# EAGLE schematic doorctrl (EAGLE 5.10)
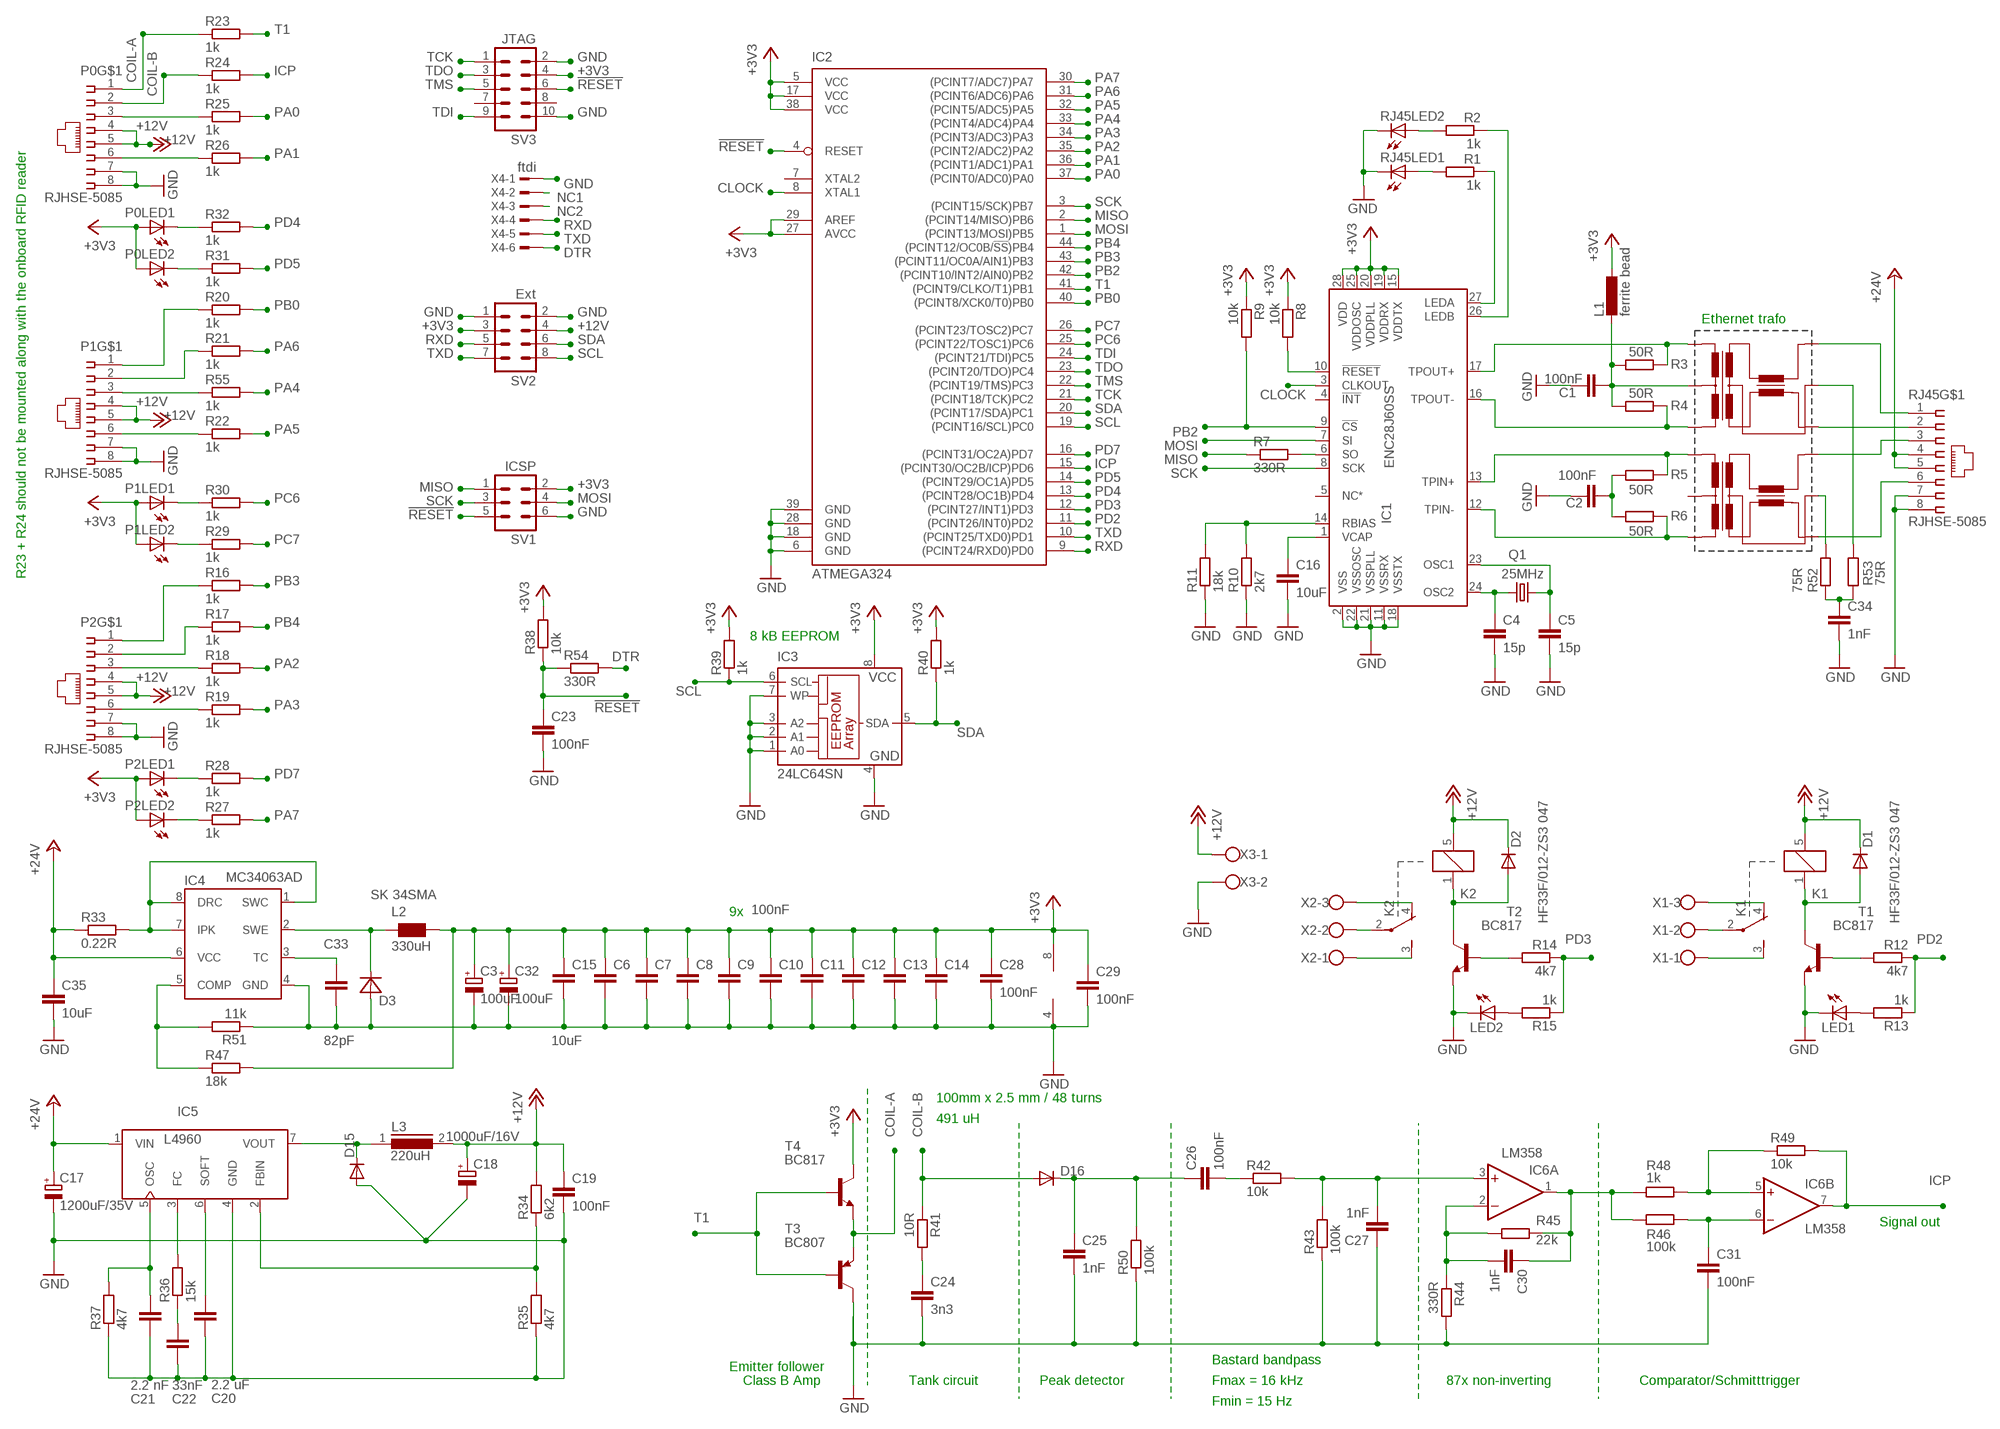
[diagram p0: schematic, sheet 1]

## Parts
C1  100nF  C-EUC0805  [C0805]
C2  100nF  C-EUC0805  [C0805]
C3  100uF  CPOL-EUSANYO_SMD_C6  [SANYO-OSCON_SMD_C6]
C4  15p  C-EUC0805  [C0805]
C5  15p  C-EUC0805  [C0805]
C6  100nF  C-EUC0805  [C0805]
C7  100nF  C-EUC0805  [C0805]
C8  100nF  C-EUC0805  [C0805]
C9  100nF  C-EUC0805  [C0805]
C10  100nF  C-EUC0805  [C0805]
C11  100nF  C-EUC0805  [C0805]
C12  100nF  C-EUC0805  [C0805]
C13  100nF  C-EUC0805  [C0805]
C14  100nF  C-EUC0805  [C0805]
C15  10uF  C-EUC0805  [C0805]
C16  10uF  C-EUC0805  [C0805]
C17  1200uF/35V  CPOL-EUE5-13  [E5-13]
C18  1000uF/16V  CPOL-EUE5-13  [E5-13]
C19  100nF  C-EUC0805  [C0805]
C20  2.2 uF  C-EUC0805  [C0805]
C21  2.2 nF  C-EUC0805  [C0805]
C22  33nF  C-EUC0805  [C0805]
C23  100nF  C-EUC0805  [C0805]
C24  3n3  C-EUC0805  [C0805]
C25  1nF  C-EUC0805  [C0805]
C26  100nF  C-EUC0805  [C0805]
C27  1nF  C-EUC0805  [C0805]
C28  100nF  C-EUC0805  [C0805]
C29  100nF  C-EUC0805  [C0805]
C30  1nF  C-EUC0805  [C0805]
C31  100nF  C-EUC0805  [C0805]
C32  100uF  CPOL-EUSANYO_SMD_C6  [SANYO-OSCON_SMD_C6]
C33  82pF  C-EUC0805  [C0805]
C34  1nF  C-EUC0805  [C0805]
C35  10uF  C-EUC0805  [C0805]
D1  DIODE-MINIMELF  [MINIMELF]
D2  DIODE-MINIMELF  [MINIMELF]
D3  SK 34SMA  MBRA340T3  [SMA]
D15  DIODE-TO220V  [TO220ACS]
D16  DIODE-MINIMELF  [MINIMELF]
IC1  ENC28J60SS  [SSOP28]
IC2  ATMEGA324  ATMEGA644A  [TQFP44]
IC3  24LC64SN  [SO-08]
IC4  MC34063AD  [SO08]
IC5  L4960  [HEPTAWATT]
IC6  LM358  LM358D  [SO08]
K1  HF33F/012-ZS3 047  G5SB  [G5SB]
K2  HF33F/012-ZS3 047  G5SB  [G5SB]
L1  ferrite bead  L-EU0204V  [0204V@1]
L2  330uH  WE-TI_L  [WE-TI_L]
L3  220uH  A26GFC  [A26GFC]
LED1  LEDCHIP-LED0805  [CHIP-LED0805]
LED2  LEDCHIP-LED0805  [CHIP-LED0805]
P0  RJHSE-5085  [RJ45]
P1  RJHSE-5085  [RJ45]
P2  RJHSE-5085  [RJ45]
Q1  25MHz  CRYSTALHC49UP  [HC49UP]
R1  1k  R-EU_R0805  [R0805]
R2  1k  R-EU_R0805  [R0805]
R3  50R  R-EU_R0805  [R0805]
R4  50R  R-EU_R0805  [R0805]
R5  50R  R-EU_R0805  [R0805]
R6  50R  R-EU_R0805  [R0805]
R7  330R  R-EU_R0805  [R0805]
R8  10k  R-EU_R0805  [R0805]
R9  10k  R-EU_R0805  [R0805]
R10  2k7  R-EU_R0805  [R0805]
R11  18k  R-EU_R0805  [R0805]
R12  4k7  R-EU_R0805  [R0805]
R13  1k  R-EU_R0805  [R0805]
R14  4k7  R-EU_R0805  [R0805]
R15  1k  R-EU_R0805  [R0805]
R16  1k  R-EU_R0805  [R0805]
R17  1k  R-EU_R0805  [R0805]
R18  1k  R-EU_R0805  [R0805]
R19  1k  R-EU_R0805  [R0805]
R20  1k  R-EU_R0805  [R0805]
R21  1k  R-EU_R0805  [R0805]
R22  1k  R-EU_R0805  [R0805]
R23  1k  R-EU_R0805  [R0805]
R24  1k  R-EU_R0805  [R0805]
R25  1k  R-EU_R0805  [R0805]
R26  1k  R-EU_R0805  [R0805]
R27  1k  R-EU_R0805  [R0805]
R28  1k  R-EU_R0805  [R0805]
R29  1k  R-EU_R0805  [R0805]
R30  1k  R-EU_R0805  [R0805]
R31  1k  R-EU_R0805  [R0805]
R32  1k  R-EU_R0805  [R0805]
R33  0.22R  R-EU_0204/2V  [0204V]
R34  6k2  R-EU_R0805  [R0805]
R35  4k7  R-EU_R0805  [R0805]
R36  15k  R-EU_R0805  [R0805]
R37  4k7  R-EU_R0805  [R0805]
R38  10k  R-EU_R0805  [R0805]
R39  1k  R-EU_R0805  [R0805]
R40  1k  R-EU_R0805  [R0805]
R41  10R  R-EU_R0805  [R0805]
R42  10k  R-EU_R0805  [R0805]
R43  100k  R-EU_R0805  [R0805]
R44  330R  R-EU_R0805  [R0805]
R45  22k  R-EU_R0805  [R0805]
R46  100k  R-EU_R0805  [R0805]
R47  18k  R-EU_R0805  [R0805]
R48  1k  R-EU_R0805  [R0805]
R49  10k  R-EU_R0805  [R0805]
R50  100k  R-EU_R0805  [R0805]
R51  11k  R-EU_R0805  [R0805]
R52  75R  R-EU_R0805  [R0805]
R53  75R  R-EU_R0805  [R0805]
R54  330R  R-EU_R0805  [R0805]
R55  1k  R-EU_R0805  [R0805]
RJ45  RJHSE-5085  [RJ45]
SV1  ICSP  MA03-2  [MA03-2]
SV2  Ext  MA04-2  [MA04-2]
SV3  JTAG  MA05-2  [MA05-2]
T1  BC817  BC817-16-NPN-SOT23-BEC  [SOT23-BEC]
T2  BC817  BC817-16-NPN-SOT23-BEC  [SOT23-BEC]
T3  BC807  BC807-16-PNP-SOT23-BEC  [SOT23-BEC]
T4  BC817  BC817-16-NPN-SOT23-BEC  [SOT23-BEC]
U$1  PE-68517L  [PE-68517]
X1  W237-103  [W237-103]
X2  W237-103  [W237-103]
X3  W237-102  [W237-102]
X4  ftdi  TSW-106-02-S-S  [TSW-106-02-S-S]

## Nets
12VPULSE: D15.C IC5.7(VOUT) L3.1
!RESET: C23.1 IC2.4(RESET) R38.1 R54.1 SV1.5 SV3.6
+3V3: C3.+ C6.1 C7.1 C8.1 C9.1 C10.1 C11.1 C12.1 C13.1 C14.1 C15.1 C28.1 C29.1 C32.+ IC1.15(VDDTX) IC1.19(VDDRX) IC1.20(VDDPLL) IC1.25(VDDOSC) IC1.28(VDD) IC2.5(VCC) IC2.17(VCC) IC2.27(AVCC) IC2.29(AREF) IC2.38(VCC) IC3.8(VCC) IC6.8(P:V+) L1.1 L2.1 P0.10(LED1:A) P0.12(LED2:A) P1.10(LED1:A) P1.12(LED2:A) P2.10(LED1:A) P2.12(LED2:A) R8.1 R9.1 R38.2 R39.2 R40.2 R47.2 SV1.2 SV2.3 SV3.4 T4.C
+12V: C18.+ C19.1 D1.C D2.C K1.5 K2.5 L3.2 P0.4 P0.5 P1.4 P1.5 P2.4 P2.5 R34.2 SV2.4 X3.1
+24V: C17.+ C35.1 IC4.6(VCC) IC5.1(VIN) R33.1 RJ45.4 RJ45.5
CLOCK: IC1.3(CLKOUT) IC2.8(XTAL1)
COIL-A: P0.1 R23.1 T3.E T4.E
COIL-B: D16.A P0.2 R24.1 R41.1
DTR: R54.2 X4.6
FC: IC5.3(FC) R36.2
GND: C1.1 C2.1 C3.- C4.2 C5.2 C6.2 C7.2 C8.2 C9.2 C10.2 C11.2 C12.2 C13.2 C14.2 C15.2 C16.2 C17.- C18.- C19.2 C20.2 C21.2 C22.2 C23.2 C24.2 C25.2 C27.1 C28.2 C29.2 C31.2 C32.- C33.2 C34.2 C35.2 D3.A D15.A IC1.2(VSS) IC1.11(VSSRX) IC1.18(VSSTX) IC1.21(VSSPLL) IC1.22(VSSOSC) IC2.6(GND) IC2.18(GND) IC2.28(GND) IC2.39(GND) IC3.1(A0) IC3.2(A1) IC3.3(A2) IC3.4(GND) IC3.7(WP) IC4.4(GND) IC5.4(GND) IC6.4(P:V-) LED1.C LED2.C P0.7 P0.8 P1.7 P1.8 P2.7 P2.8 R10.1 R11.1 R35.1 R37.1 R43.1 R44.2 R50.1 R51.1 RJ45.7 RJ45.8 RJ45.9(LED1:C) RJ45.11(LED2:C) SV1.6 SV2.1 SV2.2 SV3.2 SV3.10 T1.E T2.E T3.C X3.2 X4.1
ICP: IC2.15((PCINT30/OC2B/ICP)PD6) IC6.7(B:OUT) R24.2 R49.2
MEH1: P1.2 R21.1
MEH2: P1.1 R20.1
MISO: IC2.2((PCINT14/MISO)PB6) R7.1 SV1.1
MOSI: IC1.7(SI) IC2.1((PCINT13/MOSI)PB5) SV1.4
N$1: RJ45.1 U$1.9(RX+)
N$2: RJ45.2 U$1.10(RX-)
N$3: RJ45.3 U$1.8(TX+)
N$4: RJ45.6 U$1.7(TX-)
N$5: R2.2 RJ45.12(LED2:A)
N$6: R1.2 RJ45.10(LED1:A)
N$7: IC1.27(LEDA) R1.1
N$8: IC1.26(LEDB) R2.1
N$9: C1.2 L1.2 R3.2 R4.2 U$1.14(RCT)
N$10: P1.3 R55.1
N$12: IC1.10(!RESET) R8.2
N$13: C2.2 R5.2 R6.2
N$16: IC1.14(RBIAS) R10.2 R11.2
N$17: C16.1 IC1.1(VCAP)
N$18: C4.1 IC1.24(OSC2) Q1.1
N$19: IC1.6(SO) R7.2
N$20: C5.1 IC1.23(OSC1) Q1.2
N$21: K2.4(U:O) X2.3
N$23: D1.A K1.1 T1.C
N$24: K1.2(U:P) X1.2
N$25: R12.2 T1.B
N$26: K1.3(U:S) X1.1
N$27: LED1.A R13.2
N$28: D2.A K2.1 T2.C
N$29: R14.2 T2.B
N$30: K1.4(U:O) X1.3
N$31: K2.2(U:P) X2.2
N$32: K2.3(U:S) X2.1
N$33: LED2.A R15.2
N$34: P2.3 R18.1
N$35: P2.2 R17.1
N$37: IC5.2(FBIN) R34.1 R35.2
N$38: C21.1 IC5.5(OSC) R37.2
N$39: C22.1 R36.1
N$40: C20.1 IC5.6(SOFT)
N$41: P2.6 R19.1
N$42: P2.1 R16.1
N$45: R52.2 U$1.6(TXCT)
N$46: IC4.1(SWC) IC4.7(IPK) IC4.8(DRC) R33.2
N$47: R53.2 U$1.11(RXCT)
N$48: P0.3 R25.1
N$51: P2.9(LED1:C) R28.1
N$52: P2.11(LED2:C) R27.1
N$56: P1.6 R22.1
N$57: P1.9(LED1:C) R30.1
N$58: P1.11(LED2:C) R29.1
N$59: P0.6 R26.1
N$60: P0.9(LED1:C) R32.1
N$61: P0.11(LED2:C) R31.1
N$62: C24.1 R41.2
N$63: C25.1 C26.1 D16.C R50.2
N$64: C26.2 R42.1
N$65: C27.2 IC6.3(A:+IN) R42.2 R43.2
N$67: C30.2 IC6.2(A:-IN) R44.1 R45.1
N$68: C33.1 IC4.3(TC)
N$69: C31.1 IC6.6(B:-IN) R46.2
N$70: C30.1 IC6.1(A:OUT) R45.2 R46.1 R48.1
N$72: C34.1 R52.1 R53.1
N$76: IC4.5(COMP) R47.1 R51.2
N$81: IC6.5(B:+IN) R48.2 R49.1
NC1: X4.2
NC2: X4.3
PA0: IC2.37((PCINT0/ADC0)PA0) R25.2
PA1: IC2.36((PCINT1/ADC1)PA1) R26.2
PA2: IC2.35((PCINT2/ADC2)PA2) R18.2
PA3: IC2.34((PCINT3/ADC3)PA3) R19.2
PA4: IC2.33((PCINT4/ADC4)PA4) R55.2
PA5: IC2.32((PCINT5/ADC5)PA5) R22.2
PA6: IC2.31((PCINT6/ADC6)PA6) R21.2
PA7: IC2.30((PCINT7/ADC7)PA7) R27.2
PB0: IC2.40((PCINT8/XCK0/T0)PB0) R20.2
PB2: IC1.9(!CS) IC2.42((PCINT10/INT2/AIN0)PB2) R9.2
PB3: IC2.43((PCINT11/OC0A/AIN1)PB3) R16.2
PB4: IC2.44((PCINT12/OC0B/!SS!)PB4) R17.2
PC6: IC2.25((PCINT22/TOSC1)PC6) R30.2
PC7: IC2.26((PCINT23/TOSC2)PC7) R29.2
PD2: IC2.11((PCINT26/INT0)PD2) R12.1 R13.1
PD3: IC2.12((PCINT27/INT1)PD3) R14.1 R15.1
PD4: IC2.13((PCINT28/OC1B)PD4) R32.2
PD5: IC2.14((PCINT29/OC1A)PD5) R31.2
PD7: IC2.16((PCINT31/OC2A)PD7) R28.2
RXD: IC2.9((PCINT24/RXD0)PD0) SV2.5 X4.4
SCK: IC1.8(SCK) IC2.3((PCINT15/SCK)PB7) SV1.3
SCL: IC2.19((PCINT16/SCL)PC0) IC3.6(SCL) R39.1 SV2.8
SDA: IC2.20((PCINT17/SDA)PC1) IC3.5(SDA) R40.1 SV2.6
SWE: D3.C IC4.2(SWE) L2.2
T1: IC2.41((PCINT9/CLKO/T1)PB1) R23.2 T3.B T4.B
TCK: IC2.21((PCINT18/TCK)PC2) SV3.1
TDI: IC2.24((PCINT21/TDI)PC5) SV3.9
TDO: IC2.23((PCINT20/TDO)PC4) SV3.3
TMS: IC2.22((PCINT19/TMS)PC3) SV3.5
TPIN+: IC1.13(TPIN+) R5.1 U$1.1(TD+)
TPIN-: IC1.12(TPIN-) R6.1 U$1.2(TD-)
TPOUT+: IC1.17(TPOUT+) R3.1 U$1.16(RD+)
TPOUT-: IC1.16(TPOUT-) R4.1 U$1.15(RD-)
TXD: IC2.10((PCINT25/TXD0)PD1) SV2.7 X4.5
Unconnected: IC1.4(!INT) IC1.5(NC*) IC2.7(XTAL2) SV3.7 SV3.8 U$1.3(TCT)

## Notes on the sheet
- Ethernet trafo
- R23 + R24 should not be mounted along with the onboard RFID reader
- 8 kB EEPROM
- 9x
- 100mm x 2.5 mm / 48 turns
- 491 uH
- Signal out
- Bastard bandpass
- Emitter follower
- Class B Amp | Tank circuit | Peak detector | Fmax = 16 kHz | 87x non-inverting | Comparator/Schmitttrigger
- Fmin = 15 Hz

## Library data of the parts
C1 C2 C4-C16 C19-C31 C34 C35 = rcl:C-EU: CAPACITOR, European symbol
C3 C17 C18 C32 = rcl:CPOL-EU: POLARIZED CAPACITOR, European symbol
C33 = resistor:C-EU: CAPACITOR, European symbol
D1 D2 D15 D16 = diode:DIODE-: DIODE
D3 = diode:MBRA340T3: Surface Mount Schottky Power Rectifier Source: http://www.onsemi.com/pub_link/Collateral/MBRA340T3-D.PDF
IC1 = microchip-6:ENC28J60: Stand-Alone Ethernet Controller with SPI Interface Source: http://ww1.microchip.com/downloads/en/DeviceDoc/39662c.pdf
IC2 = atmel:ATMEGA644: 8-bit Microcontroller with 64K Bytes In-System Programmable Flash Source: http://www.atmel.com/dyn/resources/prod_documents/doc2593.pdf
IC3 = microchip:24*: Serial EEPROM I2C
IC4 = v-reg-3:MC34063A: 1.5A Step-Up/Down/Inverting Switching Regulator NPN Darlington Switch, Vin 3V to 40V, Current Limiter Input, adjustable Frequency up to 100kHz
IC5 = l4960:L4960: 2.5A POWER SWITCHING REGULATOR
IC6 = linear:LM358: OP AMP also LM158; LM258; LM2904 Source: http://cache.national.com/ds/LM/LM158.pdf
K1 K2 = relay:G5SB: Compact Single-pole Relay for Switching 5 A Source: http://www.omron.com/ecb/products/pry/121/g5sb.html
L1 = rcl:L-EU: INDUCTOR, European symbol
L2 = wuerth-elektronik:WE-TI: Radial Leaded Wire Wound Inductor WE-TI A low-cost storage/filtering possibility in comparison to SMD versions - Radial through-hole inductor - High saturation core material -- Signal filtering -- NF-switches
L3 = inductors:A26GFC: INDUCTOR
LED1 LED2 = led:LED: LED OSRAM: - CHIPLED LG R971, LG N971, LY N971, LG Q971, LY Q971, LO R971, LY R971 LH N974, LH R974 LS Q976, LO Q976, LY Q976 LO Q996 - Hyper CHIPLED LW Q18S LB Q993, LB Q99A, LB R99A - SideLED LS A670, LO A670, LY A670, LG A670, LP A670 LB A673, LV A673, LT A673, LW A673 LH A674 LY A675 LS A676, LA A676, LO A676, LY A676, LW A676 LS A679, LY A679, LG A679 - Hyper Micro SIDELED® LS Y876, LA Y876, LO Y876, LY Y876 LT Y87S - SmartLED LW L88C, LW L88S LB L89C, LB L89S, LG L890 LS L89K, LO L89K, LY L89K LS L896, LA L896, LO L896, LY L896 - TOPLED LS T670, LO T670, LY T670, LG T670, LP T670 LSG T670, LSP T670, LSY T670, LOP T670, LYG T670 LG T671, LOG T671, LSG T671 LB T673, LV T673, LT T673, LW T673 LH T674 LS T676, LA T676, LO T676, LY T676, LB T676, LH T676, LSB T676, LW T676 LB T67C, LV T67C, LT T67C, LS T67K, LO T67K, LY T67K, LW E67C LS E67B, LA E67B, LO E67B, LY E67B, LB E67C, LV E67C, LT E67C LW T67C LS T679, LY T679, LG T679 LS T770, LO T770, LY T770, LG T770, LP T770 LB T773, LV T773, LT T773, LW T773 LH T774 LS E675, LA E675, LY E675, LS T675 LS T776, LA T776, LO T776, LY T776, LB T776 LHGB T686 LT T68C, LB T68C - Hyper Mini TOPLED® LB M676 - Mini TOPLED Santana® LG M470 LS M47K, LO M47K, LY M47K Source: http://www.osram.convergy.de LUXEON: - LUMILED® LXK2-PW12-R00, LXK2-PW12-S00, LXK2-PW14-U00, LXK2-PW14-V00 LXK2-PM12-R00, LXK2-PM12-S00, LXK2-PM14-U00 LXK2-PE12-Q00, LXK2-PE12-R00, LXK2-PE12-S00, LXK2-PE14-T00, LXK2-PE14-U00 LXK2-PB12-K00, LXK2-PB12-L00, LXK2-PB12-M00, LXK2-PB14-N00, LXK2-PB14-P00, LXK2-PB14-Q00 LXK2-PR12-L00, LXK2-PR12-M00, LXK2-PR14-Q00, LXK2-PR14-R00 LXK2-PD12-Q00, LXK2-PD12-R00, LXK2-PD12-S00 LXK2-PH12-R00, LXK2-PH12-S00 LXK2-PL12-P00, LXK2-PL12-Q00, LXK2-PL12-R00 Source: www.luxeon.com KINGBRIGHT: KA-3528ASYC Source: www.kingbright.com
P0 P1 P2 RJ45 = amp-rj45-tap-up-with-leds:RJHSE-5085: Amphenol RJHSE-5085 - RJ45 with 2 leds and tap-up.
Q1 = crystal:CRYSTAL: CRYSTAL
R1-R55 = rcl:R-EU_: RESISTOR, European symbol
SV1 = con-lstb:MA03-2: PIN HEADER
SV2 = con-lstb:MA04-2: PIN HEADER
SV3 = con-lstb:MA05-2: PIN HEADER
T1 T2 T4 = transistor:*-NPN-: NPN Transistror BF959 corrected 2008.03.06
T3 = transistor:*-PNP-: PNP Transistror
U$1 = pulse-pe-68517-ethernet-trafo:PE-68517L
X1 X2 = con-wago-500:W237-103: WAGO SCREW CLAMP
X3 = con-wago-500:W237-102: WAGO SCREW CLAMP
X4 = con-samtec:TSW-106-02-S-S: THROUGH-HOLE .025" SQ POST HEADER Source: Samtec TSW.pdf